# EAGLE design AEDR-7810-Breakout (EAGLE 7.3.0)
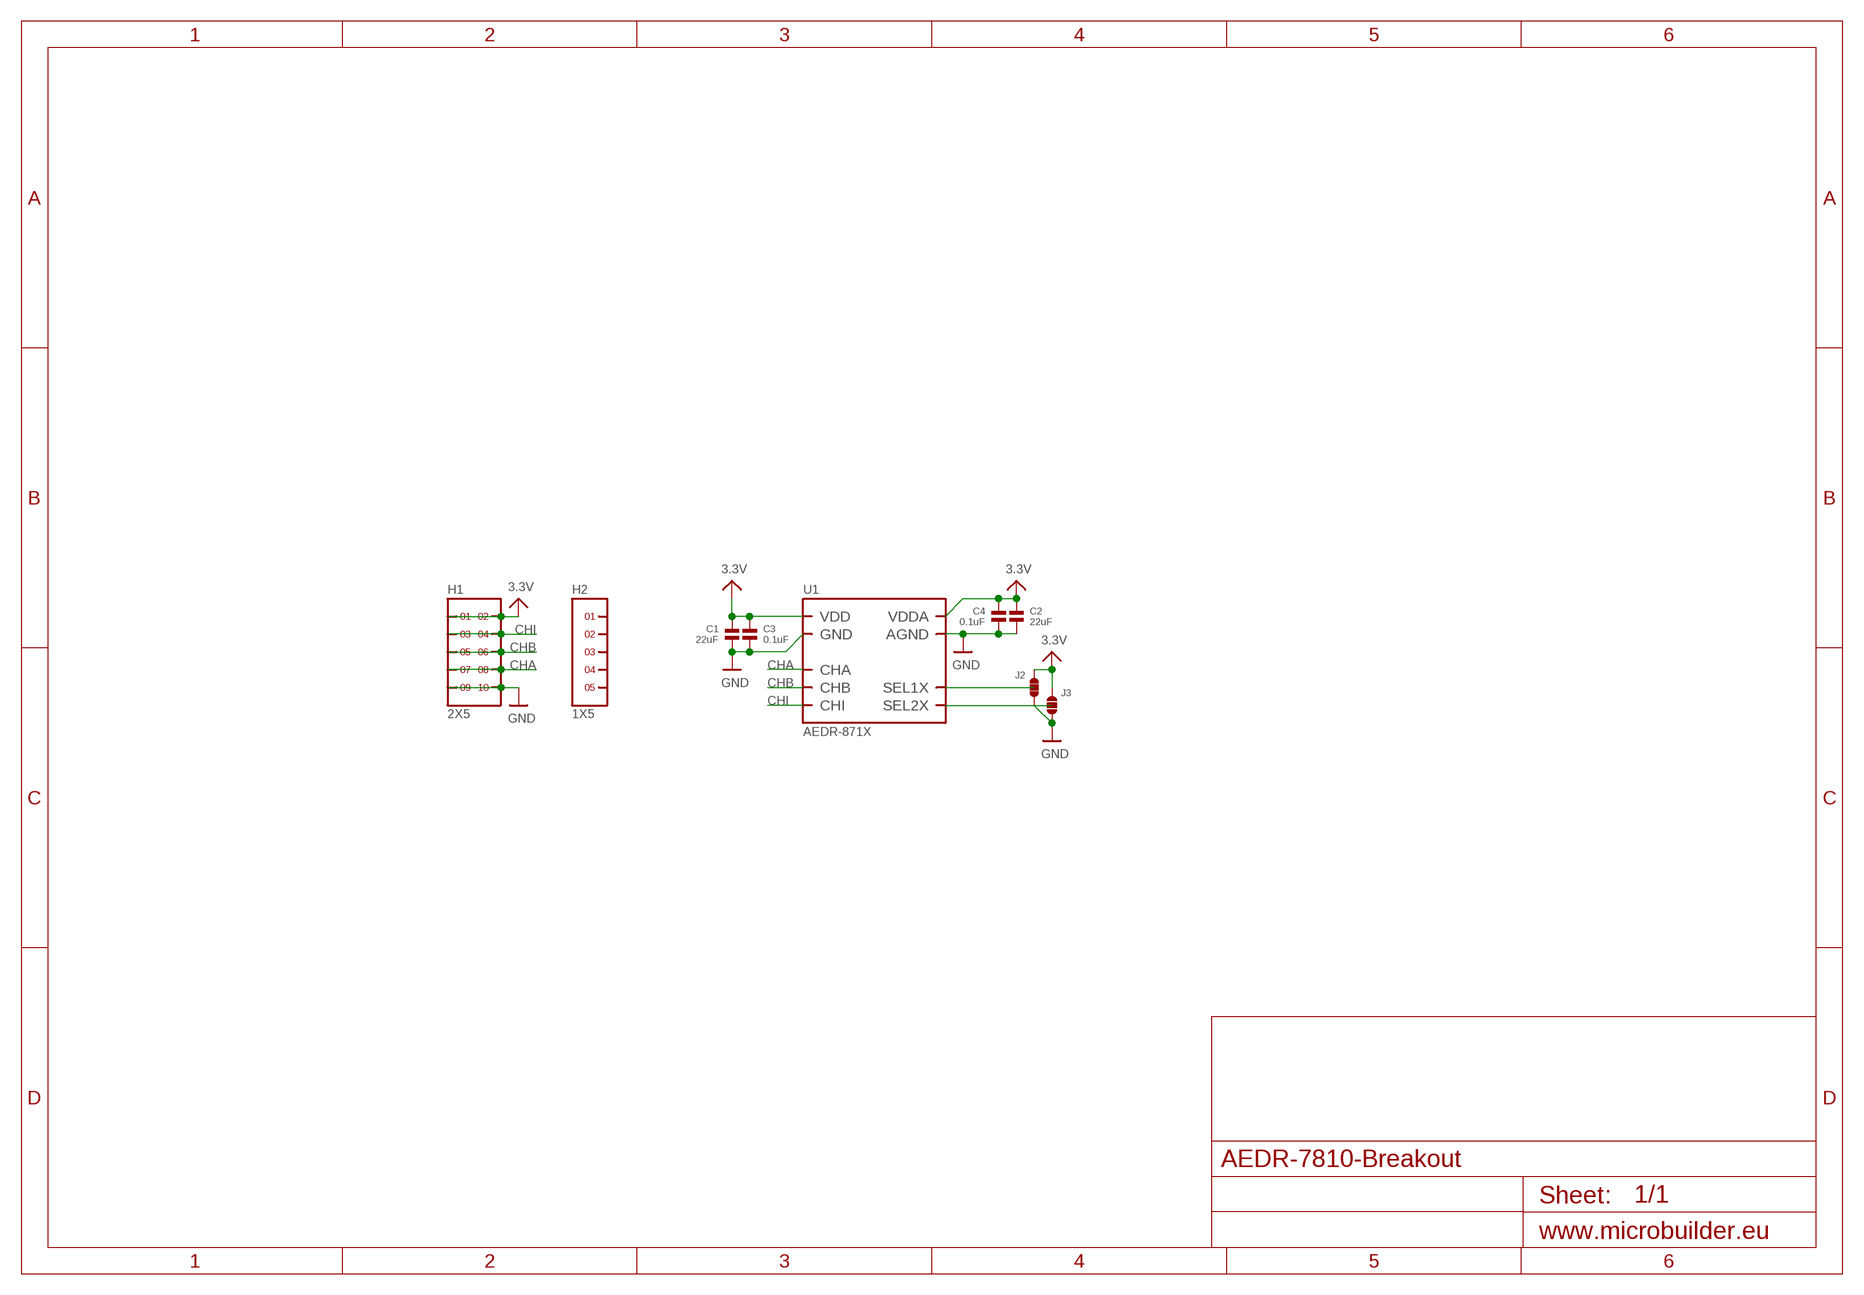
[diagram p0: schematic, sheet 1]

## Parts
C1  22uF  CAPACITOR.0805  [0805]
C2  22uF  CAPACITOR.0805  [0805]
C3  0.1uF  CAPACITOR.0603  [0603]
C4  0.1uF  CAPACITOR.0603  [0603]
H1  2X5  [2X5]
H2  1X5  [1X5]
J2  SOLDERJUMPER.3.MED.12  [3.MED.12]
J3  SOLDERJUMPER.3.MED.12  [3.MED.12]
U1  AEDR-871X  [AEDR-871X]

## Nets
3.3V: C1.1 C2.1 C3.1 C4.1 H1.1 H1.2 J2.1 J3.1 U1.1(VDDA) U1.8(VDD)
CHA: H1.7 H1.8 U1.7(CHA)
CHB: H1.5 H1.6 U1.6(CHB)
CHI: H1.3 H1.4 U1.5(CHI)
GND: C1.2 C2.2 C3.2 C4.2 H1.9 H1.10 J2.3 J3.3 U1.2(AGND) U1.PAD(GND)
N$4: J2.2 U1.3(SEL1X)
N$5: J3.2 U1.4(SEL2X)
Unconnected: H2.1 H2.2 H2.3 H2.4 H2.5

## Library data of the parts
C1-C4 = standardparts:CAPACITOR
H1 = headers(.1in):2X5
H2 = headers(.1in):1X5
J2 J3 = solderjumper:SOLDERJUMPER.3
U1 = avago:AEDR-871X

## Board
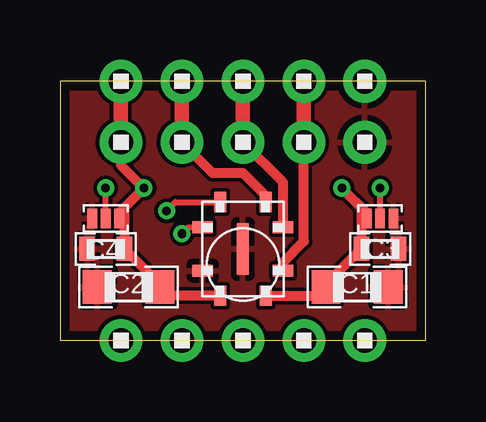
[diagram p1: board, top side]
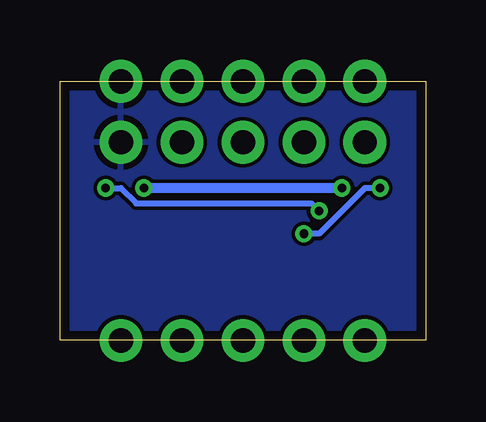
[diagram p2: board, bottom side, seen from below]

Size 15.24 x 10.79 mm. Coordinates in mm from the lower left corner, seen from the top.
Outline: 0,0 15.24,0 15.24,10.79 0,10.79 0,0
Copper layers (1*16): Top 0.0356mm / dielectric 1.5011mm / Bottom 0.0356mm
Design rules "OSHPark": minimum track width 6mil, minimum drill 13mil, track to track 6mil, track to pad 6mil, pad to pad 6mil, via to via 6mil, smd to smd 6mil, copper to edge 15mil, drill to drill 6mil, minimum pad ring 7mil, minimum via ring 7mil, stop-mask expansion 4mil, vias tented up to drill 16mil, thermal gap 10mil

### Footprints (pad centres in the part's own frame; a part is rotated, then mirrored left to right if it is on the bottom)
0805 = smd 1.2 x 1.4: 1 -1.3,0; 2 1.3,0
0603 = smd 0.65 x 1: 1 -0.775,0; 2 0.775,0
2X5 = drill 1.016 pad 1.778: 1 0,0; 2 0,2.54; 3 2.54,0; 4 2.54,2.54; 5 5.08,0; 6 5.08,2.54; 7 7.62,0; 8 7.62,2.54; 9 10.16,0; 10 10.16,2.54
1X5 = drill 1.016 pad 1.778: 1 0,0; 2 2.54,0; 3 5.08,0; 4 7.62,0; 5 10.16,0
3.MED.12 = smd 0.406 x 0.813: 1 -0.559,0; 2 0,0; 3 0.559,0
AEDR-871X = smd 0.5 x 0.85: 1 0.95,1.95; 4 0.95,-1.95; 5 -0.95,-1.95; 8 -0.95,1.95 | smd 0.85 x 0.5: 2 1.675,0.9; 3 1.675,-0.9; 6 -1.675,-0.9; 7 -1.675,0.9 | smd 0.5 x 2.15: PAD 0,0

### Placement (x,y rotation side)
C1  12.38,2.22 0 top
C2  2.86,2.22 180 top
C3  13.34,3.81 0 top
C4  1.91,3.81 180 top
H1  2.54,8.26 0 top
H2  2.54,0 0 top
J2  1.91,5.08 180 top
J3  13.34,5.08 0 top
U1  7.62,3.81 180 top

### Tracks (layer width: path | path; a pad name or v marks a point on that pad's centre or on a via)
3.3V  (via drill 0.36)
  Top 0.406: U1.1 4.52,1.86 C2.1 4.16,2.33 C4.1 2.68,5.54 v3.49,6.35 | U1.8 10.72,1.86 C1.1 11.08,2.33 C3.1 12.56,5.54 v11.75,6.35 12.78,5.32 J3.1 | H1.1 2.54,7.3 v3.49,6.35 | v3.49,6.35 2.46,5.32 J2.1
  Top 0.61: H1.1 H1.2
  Bottom 0.406: v3.49,6.35 v11.75,6.35
CHA
  Top 0.406: U1.7 9.29,3.26 10.16,4.13 H1.7
  Top 0.61: H1.7 H1.8
CHB
  Top 0.406: U1.6 9.29,6.58 H1.5
  Top 0.61: H1.5 H1.6
CHI
  Top 0.406: H1.3 6.35,6.99 7.62,6.99 8.57,6.04 U1.5
  Top 0.61: H1.3 H1.4
GND
  pour Bottom: 0,0 15.24,0 15.24,10.79 0,10.79
  pour Top: 0,0 15.24,0 15.24,10.79 0,10.79
N$4  (via drill 0.36)
  Top 0.254: J2.2 v1.91,6.35 | v5.08,4.45 5.34,4.71 U1.3
  Bottom 0.254: v1.91,6.35 2.54,6.35 4.45,4.45 v5.08,4.45
N$5  (via drill 0.36)
  Top 0.254: J3.2 v13.34,6.35 | v4.45,5.4 4.81,5.76 U1.4
  Bottom 0.254: v13.34,6.35 12.7,6.35 12.06,5.71 4.76,5.71 v4.45,5.4

### Text on the board
tDocu: 3.3v | I | B | A | GND | S1 | S2
bDocu: AEDR-871X / Breakout | Cruz Monrreal II | TheNextPlateau.com